# Altium schematic sheet SM.SchDoc: Комбинационный сумматор
size 420 x 297 mm; CheckedBy: Хисамов; Author: Радионова; SheetTotal: 1; DocumentType: Схема электрическая принципиальная; DocumentName: Sheet1.SCHDOC
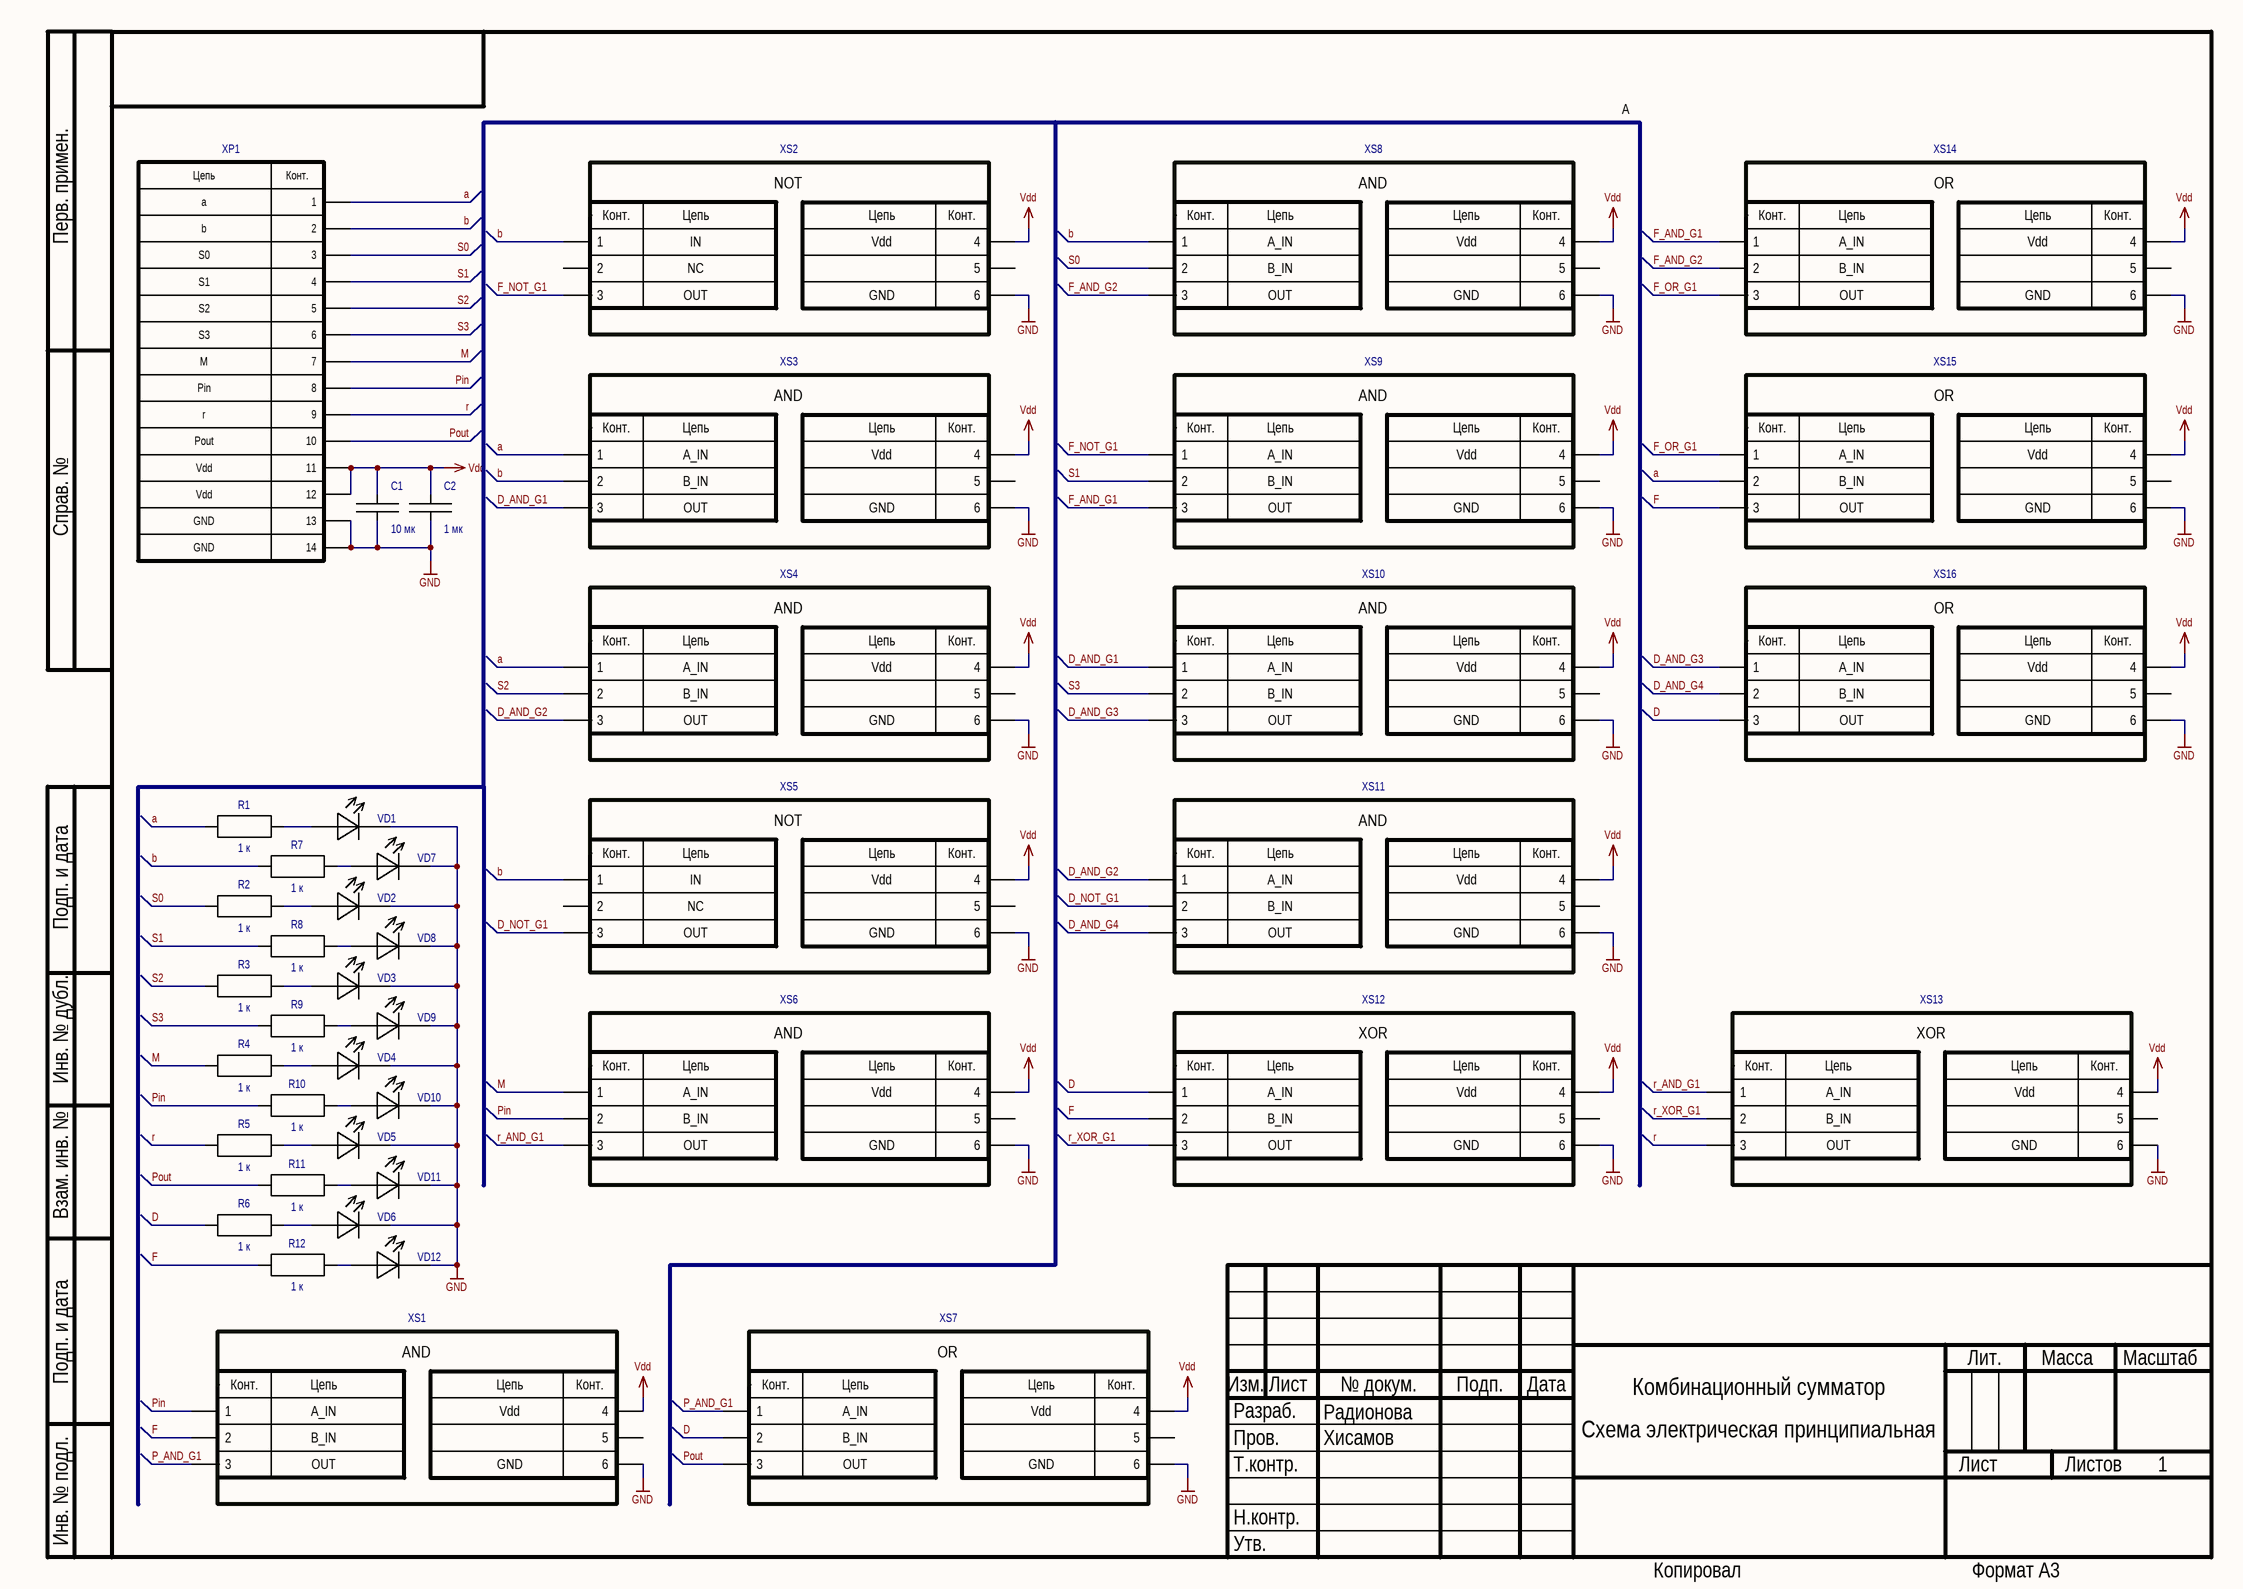
[diagram p0: SM.SchDoc]

## Parts
C1  value 10 мк  [K10-79_1.6_0.8(0603)]  (hidden comment: 10 мкФ ±* * * 0805, *)
C2  value 1 мк  [K10-79_1.6_0.8(0603)]  (hidden comment: 1 мкФ ±* * * 0603, *)
R1  value 1 к  [P1-12-0.1(0603)]
R2  value 1 к  [P1-12-0.1(0603)]
R3  value 1 к  [P1-12-0.1(0603)]
R4  value 1 к  [P1-12-0.1(0603)]
R5  value 1 к  [P1-12-0.1(0603)]
R6  value 1 к  [P1-12-0.1(0603)]
R7  value 1 к  [P1-12-0.1(0603)]
R8  value 1 к  [P1-12-0.1(0603)]
R9  value 1 к  [P1-12-0.1(0603)]
R10  value 1 к  [P1-12-0.1(0603)]
R11  value 1 к  [P1-12-0.1(0603)]
R12  value 1 к  [P1-12-0.1(0603)]
VD1  VD - Светодиод  [LED 0603]  (value not drawn)
VD2  VD - Светодиод  [LED 0603]  (value not drawn)
VD3  VD - Светодиод  [LED 0603]  (value not drawn)
VD4  VD - Светодиод  [LED 0603]  (value not drawn)
VD5  VD - Светодиод  [LED 0603]  (value not drawn)
VD6  VD - Светодиод  [LED 0603]  (value not drawn)
VD7  VD - Светодиод  [LED 0603]  (value not drawn)
VD8  VD - Светодиод  [LED 0603]  (value not drawn)
VD9  VD - Светодиод  [LED 0603]  (value not drawn)
VD10  VD - Светодиод  [LED 0603]  (value not drawn)
VD11  VD - Светодиод  [LED 0603]  (value not drawn)
VD12  VD - Светодиод  [LED 0603]  (value not drawn)
XP1  XP - Вилка - х8  [PLD-16Norm]  (value not drawn)
XS1  Модуль AND  [модуль_AND]  (value not drawn)
XS2  Модуль NOT  [модуль_NOT]  (value not drawn)
XS3  Модуль AND  [модуль_AND]  (value not drawn)
XS4  Модуль AND  [модуль_AND]  (value not drawn)
XS5  Модуль NOT  [модуль_NOT]  (value not drawn)
XS6  Модуль AND  [модуль_AND]  (value not drawn)
XS7  Модуль OR  [модуль_OR]  (value not drawn)
XS8  Модуль AND  [модуль_AND]  (value not drawn)
XS9  Модуль AND  [модуль_AND]  (value not drawn)
XS10  Модуль AND  [модуль_AND]  (value not drawn)
XS11  Модуль AND  [модуль_AND]  (value not drawn)
XS12  Модуль XOR  [модуль_XOR]  (value not drawn)
XS13  Модуль XOR  [модуль_XOR]  (value not drawn)
XS14  Модуль OR  [модуль_OR]  (value not drawn)
XS15  Модуль OR  [модуль_OR]  (value not drawn)
XS16  Модуль OR  [модуль_OR]  (value not drawn)

## Nets
GND: C1.1 C2.1 VD1.2(C) VD2.2(C) VD3.2(C) VD4.2(C) VD5.2(C) VD6.2(C) VD7.2(C) VD8.2(C) VD9.2(C) VD10.2(C) VD11.2(C) VD12.2(C) XP1.13 XP1.14 XS1.6 XS2.6 XS3.6 XS4.6 XS5.6 XS6.6 XS7.6 XS8.6 XS9.6 XS10.6 XS11.6 XS12.6 XS13.6 XS14.6 XS15.6 XS16.6
Vdd: C1.2 C2.2 XP1.11 XP1.12 XS1.4 XS2.4 XS3.4 XS4.4 XS5.4 XS6.4 XS7.4 XS8.4 XS9.4 XS10.4 XS11.4 XS12.4 XS13.4 XS14.4 XS15.4 XS16.4
a: R1.1 XP1.1 XS3.1 XS4.1 XS15.2
b: R7.1 XP1.2 XS2.1 XS3.2 XS5.1 XS8.1
D: R6.1 XS7.2 XS12.1 XS16.3
D_AND_G1: XS3.3 XS10.1
D_AND_G2: XS4.3 XS11.1
D_AND_G3: XS10.3 XS16.1
D_AND_G4: XS11.3 XS16.2
D_NOT_G1: XS5.3 XS11.2
F: R12.1 XS1.2 XS12.2 XS15.3
F_AND_G1: XS9.3 XS14.1
F_AND_G2: XS8.3 XS14.2
F_NOT_G1: XS2.3 XS9.1
F_OR_G1: XS14.3 XS15.1
M: R4.1 XP1.7 XS6.1
P_AND_G1: XS1.3 XS7.1
Pin: R10.1 XP1.8 XS1.1 XS6.2
Pout: R11.1 XP1.10 XS7.3
r: R5.1 XP1.9 XS13.3
r_AND_G1: XS6.3 XS13.1
r_XOR_G1: XS12.3 XS13.2
S0: R2.1 XP1.3 XS8.2
S1: R8.1 XP1.4 XS9.2
S2: R3.1 XP1.5 XS4.2
S3: R9.1 XP1.6 XS10.2
NetR1_2: R1.2 VD1.1(A)
NetR2_2: R2.2 VD2.1(A)
NetR3_2: R3.2 VD3.1(A)
NetR4_2: R4.2 VD4.1(A)
NetR5_2: R5.2 VD5.1(A)
NetR6_2: R6.2 VD6.1(A)
NetR7_2: R7.2 VD7.1(A)
NetR8_2: R8.2 VD8.1(A)
NetR9_2: R9.2 VD9.1(A)
NetR10_2: R10.2 VD10.1(A)
NetR11_2: R11.2 VD11.1(A)
NetR12_2: R12.2 VD12.1(A)

Not connected (* = marked no-connect by the designer): XS1 5; XS2 2 5; XS3 5; XS4 5; XS5 2 5; XS6 5; XS7 5; XS8 5; XS9 5; XS10 5; XS11 5; XS12 5; XS13 5; XS14 5; XS15 5; XS16 5

## Notes on the sheet
- A
- Перв. примен.
- Справ. №
- Подп. и дата
- Инв. № дубл.
- Взам. инв. №
- Разраб.
- Изм.
- Лист
- № докум.
- Подп.
- Дата
- Лит.
- Масса
- Масштаб
- Пров.
- Т.контр.
- Листов
- Инв. № подл.
- Утв.
- Н.контр.
- Копировал
- Формат А3
- (in symbol XP - розетка- х14) Цепь; Конт.; a; b; S0; S1; S2; S3; M; Pin; Pout; Vdd; GND
- (in symbol Модуль AND) AND; Конт.; Цепь; A_IN; Vdd; B_IN; OUT; GND
- (in symbol Модуль NOT) NOT; Конт.; Цепь; IN; Vdd; NC; OUT; GND
- (in symbol Модуль OR) OR; Конт.; Цепь; A_IN; Vdd; B_IN; OUT; GND
- (in symbol Модуль XOR) XOR; Конт.; Цепь; A_IN; Vdd; B_IN; OUT; GND

## Library data of the parts
C1 C2 = C - Конденсатор: Company: *; PartNumber: *; Tolerance: *; Voltage: *; Type: *
  C1: Package: 0805
  C2: Package: 0603
R1-R12 = R - Резистор: Company: *; PartNumber: *; Package: 0603; Tolerance: *
XP1 = XP - розетка- х14: 9: r
VD1-VD12 = VD - Светодиод: Package: 0603
XS1 XS3 XS4 XS6 XS8-XS11 = Модуль AND: Package: Case-AND
XS2 XS5 = Модуль NOT: Package: Case-NOT
XS7 XS14-XS16 = Модуль OR: Package: Case-OR
XS12 XS13 = Модуль XOR: Package: Case-XOR